# Altium schematic sheet LF_v5_HM10_Conn.SchDoc
size A4
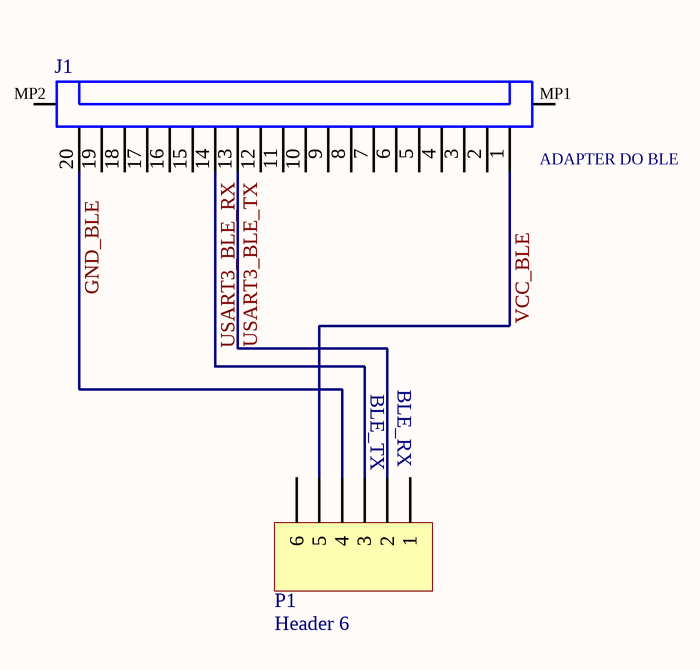
[diagram p0: LF_v5_HM10_Conn.SchDoc]

## Parts
J1  ADAPTER DO BLE  [687120183722]
P1  Header 6  [HDR1X6]

## Nets
GND_BLE: J1.20 P1.4
USART3_BLE_RX: J1.14 P1.3
USART3_BLE_TX: J1.13 P1.2
VCC_BLE: J1.1 P1.5

Not connected (* = marked no-connect by the designer): J1 2 3 4 5 6 7 8 9 10 11 12 15 16 17 18 19 MP1 MP2; P1 1 6

## Notes on the sheet
- (near P1) BLE_TX
- (near P1) BLE_RX
- Title
- Size:
- Date:
- A4
- Number:
- Time:
- Revision:
- Sheet
- of
- File:

## Library data of the parts
J1 = CMP-1502-01579-1: SMT ZIF Connectors Low Profile WR-FPC, Horizontal, Bottom Contact, pitch 0.5 mm, 20 pins; Manufacturer: Wurth Elektronik; Rated Current: 0.4A; Pin Number: 20; Withstanding Voltage: 250VAC; Contact Resistance: 30mOhm; Working Voltage: 50VAC; Pitch: 0.5mm; Package Reference: 687120183722; Publisher: WurthElektronik; Packaging: TapeandReel; Part Number: 687120183722; Operating Temperature: -25to85degC; Orientation: Horizontal; Datasheet URL: https://katalog.we-online.de/em/datasheet/687120183722.pdf; Contact Design: BottomContact; Manufacturer URL: http://www.we-online.de; Mounting Technology: SMT
P1 = Header 6: Header, 6-Pin; LatestRevisionDate: 17-Jul-2002; LatestRevisionNote: Re-released for DXP Platform.; Publisher: Altium Limited